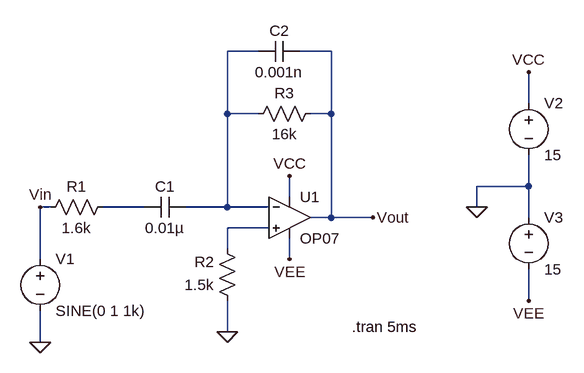
[diagram p0: schematic Differentiator.asc]
Differentiator.asc, the LTspice schematic file:
Version 4.1
SHEET 1 880 680
WIRE 144 -96 96 -96
WIRE 256 -96 208 -96
WIRE 560 -16 560 -64
WIRE 96 0 96 -96
WIRE 144 0 96 0
WIRE 256 0 256 -96
WIRE 256 0 224 0
WIRE 560 112 560 64
WIRE 560 112 480 112
WIRE 192 128 192 96
WIRE -176 144 -192 144
WIRE -32 144 -96 144
WIRE 96 144 96 0
WIRE 96 144 32 144
WIRE 160 144 96 144
WIRE 480 144 480 112
WIRE 256 160 256 0
WIRE 256 160 224 160
WIRE 320 160 256 160
WIRE 560 160 560 112
WIRE 160 176 96 176
WIRE 96 208 96 176
WIRE -192 224 -192 144
WIRE 192 224 192 192
WIRE 560 288 560 240
WIRE 96 336 96 288
WIRE -192 352 -192 304
FLAG 480 144 0
FLAG 96 336 0
FLAG -192 352 0
FLAG 320 160 Vout
FLAG 192 224 VEE
FLAG 560 288 VEE
FLAG 192 96 VCC
FLAG 560 -64 VCC
FLAG -192 144 Vin
SYMBOL OpAmps\\OP07 192 96 R0
SYMATTR InstName U1
SYMBOL res -80 128 R90
WINDOW 0 0 56 VBottom 2
WINDOW 3 32 56 VTop 2
SYMATTR InstName R1
SYMATTR Value 1.6k
SYMBOL res 112 304 R180
WINDOW 0 36 76 Left 2
WINDOW 3 36 40 Left 2
SYMATTR InstName R2
SYMATTR Value 1.5k
SYMBOL res 128 16 R270
WINDOW 0 32 56 VTop 2
WINDOW 3 0 56 VBottom 2
SYMATTR InstName R3
SYMATTR Value 16k
SYMBOL cap 32 128 R90
WINDOW 0 0 32 VBottom 2
WINDOW 3 32 32 VTop 2
SYMATTR InstName C1
SYMATTR Value 0.01µ
SYMBOL cap 208 -112 R90
WINDOW 0 0 32 VBottom 2
WINDOW 3 32 32 VTop 2
SYMATTR InstName C2
SYMATTR Value 0.001n
SYMBOL voltage -192 208 R0
WINDOW 123 0 0 Left 0
WINDOW 39 0 0 Left 0
SYMATTR InstName V1
SYMATTR Value SINE(0 1 1k)
SYMBOL voltage 560 -32 R0
WINDOW 123 0 0 Left 0
WINDOW 39 0 0 Left 0
SYMATTR InstName V2
SYMATTR Value 15
SYMBOL voltage 560 144 R0
WINDOW 123 0 0 Left 0
WINDOW 39 0 0 Left 0
SYMATTR InstName V3
SYMATTR Value 15
TEXT 288 328 Left 2 !.tran 5ms

The netlist it stands for:
* Differentiator.asc
X§U1 N003 N001 VCC VEE Vout LT1001  ; OP07, pins In+ In- V+ V- OUT
R1 N002 Vin 1.6k
R2 0 N003 1.5k
R3 N001 Vout 16k
C1 N001 N002 0.01µ
C2 Vout N001 0.001n
V1 Vin 0 SINE(0 1 1k)
V2 VCC 0 15
V3 0 VEE 15
.tran 5ms
.lib LTC.lib
.backanno
.end